# Altium schematic sheet 1_P1.schdoc
size 307 x 218 mm; Symbol: Sheet-Symbol_A4; Device: Sheet-Symbol_A4; Company: 嘉立创EDA; Version: V1.0; Page Size: A4; @Project Name: 332G_2025-04-08_13-48-16; @Page Count: 1; @Update Date: 2025-04-08; @Create Date: 2025-04-08; @Schematic Name: Schematic1; @Page No: 1; @Page Name: P1; Title Block Position: 3; Width: 1170; Height: 825; Region Start: 1; X Region Count: 6; Y Region Count: 4; Blade Width: 10; @Board Name: Board1; @Create Time: 13:48:31; @Update Time: 14:45:20
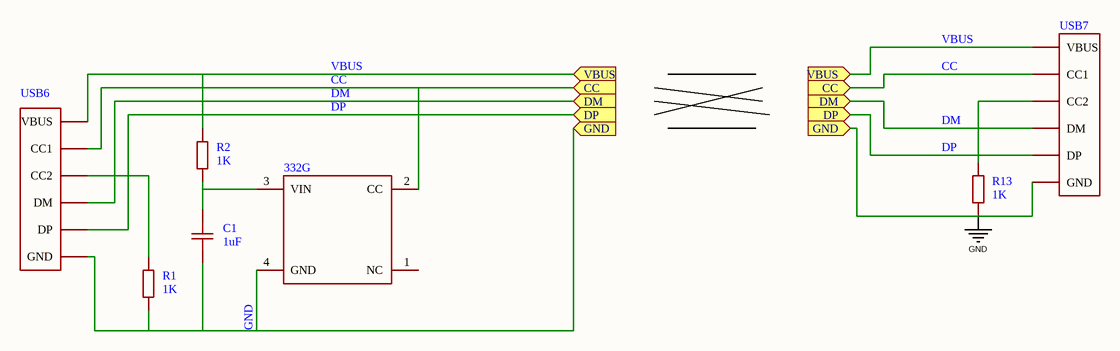
[diagram p0: 1_P1.schdoc]

## Parts
332G  (no value)  [ODFN-4_L1.6-W1.6]
C1  value 1uF  [0603C]
R1  1K  [0603R]
R2  1K  [R0603]
R13  1K  [0603R]
USB6  (no value)  [TYPE-C14P]
USB7  (no value)  [TYPE-C14P]

## Ports
CC (in), DM (in), DP (in), GND (in), VBUS (in)

## Nets
GND: 332G.4(GND) C1.2 R1.1 R13.1 USB6.GND USB7.GND ; port GND
CC: 332G.2(CC) USB6.CC1 USB7.CC1 ; port CC
DM: USB6.DM USB7.DM ; port DM
DP: USB6.DP USB7.DP ; port DP
VBUS: R2.2 USB6.VBUS USB7.VBUS ; port VBUS
Net332G_3: 332G.3(VIN) C1.1 R2.1
NetR1_2: R1.2 USB6.CC2
NetR13_2: R13.2 USB7.CC2

Not connected (* = marked no-connect by the designer): 332G 1(NC)

## Notes on the sheet
- 1
- 2
- 3
- 4
- 5
- 6
- A
- B
- C
- 原理图
- Schematic1
- 创建日期
- 更新日期
- 2025-04-08
- 绘制
- 图页
- P1
- 物料编码
- D
- 审阅
- 版本
- 尺寸
- 332G_2025-04-08_13-48-16
- 页
- 共
- V1.0
- A4
- 嘉立创EDA

## Library data of the parts
332G = 332G: Add into BOM: yes; Symbol: 332G; Device: 332G; Convert to PCB: yes
C1 = 1uF: Add into BOM: yes; Symbol: 0603C; Device: 1uF; Convert to PCB: yes
R1 R13 = 10K: Add into BOM: yes; Symbol: 10K; Device: 10K; Value: 1K; Convert to PCB: yes
R2 = Res_0603: Symbol: 电阻; Convert to PCB: yes; Device: Res_0603; Add into BOM: yes; Supplier Footprint: 0603; Value: 1K
USB6 USB7 = TYPEC-14PIN(公头）: Add into BOM: yes; Symbol: TYPEC-14PIN(公头）; Device: TYPEC-14PIN(公头）; Convert to PCB: yes